# EAGLE design Amplifier_AB_V1 (EAGLE 7.7.0)
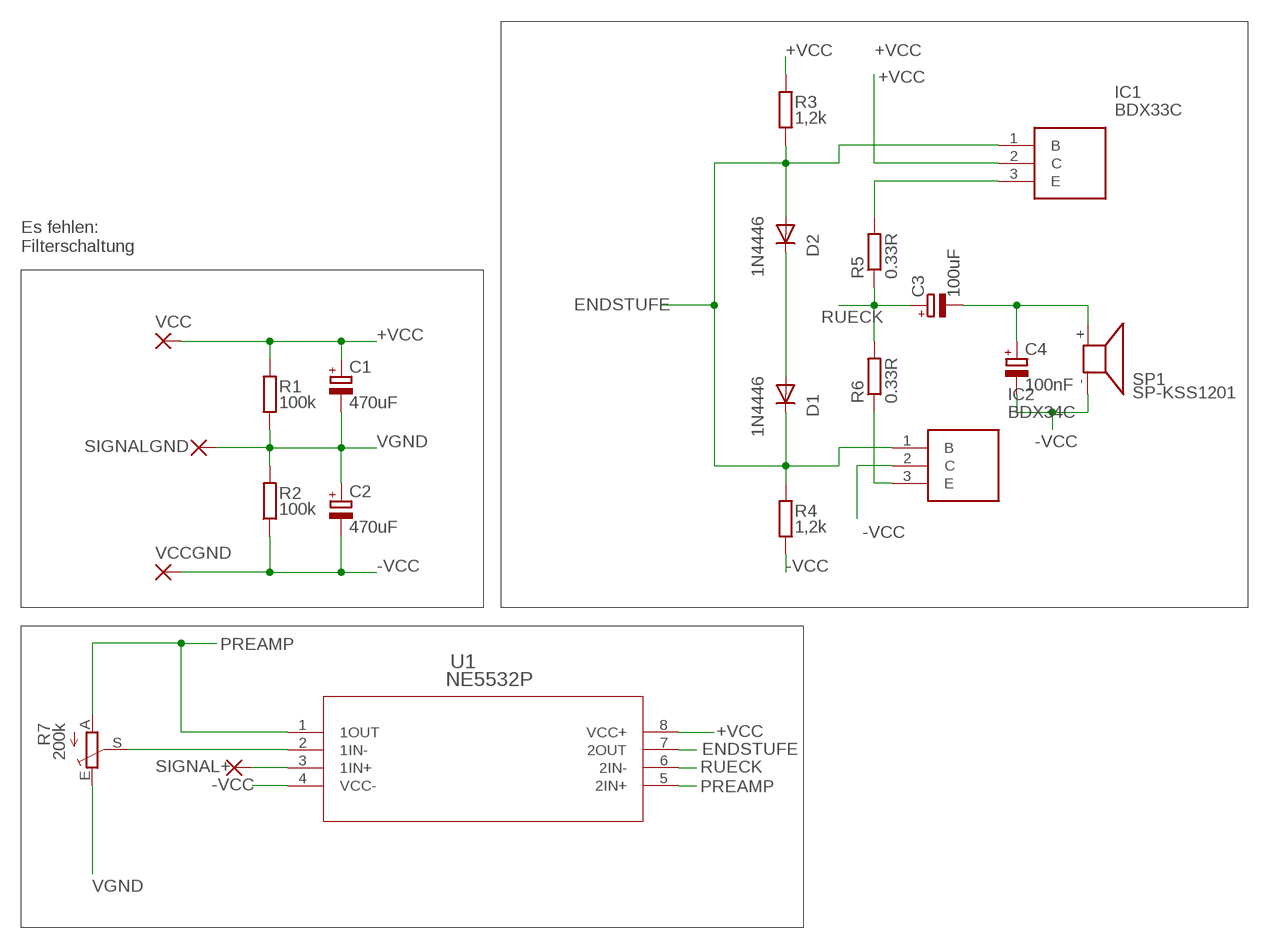
[diagram p0: schematic, sheet 1]

## Parts
C1  470uF  CE_2,5-5  [2,5-5]
C2  470uF  CE_2,5-5  [2,5-5]
C3  100uF  CE_5-10,5  [5-10,5]
C4  100nF  CE_5-10,5  [5-10,5]
D1  1N4446  [DO35-10]
D2  1N4446  [DO35-10]
IC1  BDX33C  [TO270P460X1020X2008-3P]
IC2  BDX34C  [TO270P460X1020X2008-3P]
R1  100k  R10  [0207/10]
R2  100k  R10  [0207/10]
R3  1,2k  R10  [0207/10]
R4  1,2k  R10  [0207/10]
R5  0.33R  R-EU_0309/12  [0309/12]
R6  0.33R  R-EU_0309/12  [0309/12]
R7  200k  TRIM_EU-CT6  [CT6]
SIGNAL+  2,15/1,0  [2,15/1,0]
SIGNALGND  2,15/1,0  [2,15/1,0]
SP1  SP-KSS1201  [SP-KSS1201]
U1  NE5532P  [P8]
VCC  2,15/1,0  [2,15/1,0]
VCCGND  2,15/1,0  [2,15/1,0]

## Nets
+VCC: C1.+ IC1.2(C) R1.2 R3.2 U1.8(VCC+) VCC.1(P)
-VCC: C2.- C4.- IC2.2(C) R2.1 R4.1 SP1.- U1.4(VCC-) VCCGND.1(P)
ENDSTUFE: D1.C D2.A IC1.1(B) IC2.1(B) R3.1 R4.2 U1.7(2OUT)
N$1: IC1.3(E) R5.2
N$2: R7.S U1.2(1IN-)
N$3: C3.- C4.+ SP1.+
N$4: D1.A D2.C
N$5: IC2.3(E) R6.1
N$6: SIGNAL+.1(P) U1.3(1IN+)
PREAMP: R7.A U1.1(1OUT) U1.5(2IN+)
RUECK: C3.+ R5.1 R6.2 U1.6(2IN-)
VGND: C1.- C2.+ R1.1 R2.2 R7.E SIGNALGND.1(P)

## Notes on the sheet
- Es fehlen:
  Filterschaltung

## Library data of the parts
C1-C4 = 0_HTL_analog:CE*: Elko
D1 D2 = diode:1N4446: DIODE high speed (Philips)
IC1 = BDX33C:BDX33C: BDX33C, Darlington Transistor, NPN 10 A 100 V HFE:750, 3-Pin, TO-220 Source: Datasheet <http://www.st.com/web/en/resource/technical/document/datasheet/CD00000901.pdf>; DESCRIPTION: BDX33C, Darlington Transistor, NPN 10 A 100 V HFE:750, 3-Pin, TO-220; HEIGHT: 4.6mm; MANUFACTURER_NAME: STMicroelectronics; MANUFACTURER_PART_NUMBER: BDX33C; MOUSER_PART_NUMBER: 511-BDX33C; MOUSER_PRICE-STOCK: https://www.mouser.co.uk/ProductDetail/STMicroelectronics/BDX33C?qs=W6IoFmhM3rXCvTnlzdpsKw%3D%3D
IC2 = BDX34C:BDX34C: BDX34C, Darlington Transistor, PNP 10 A 100 V HFE:750, 3-Pin, TO-220 Source: Datasheet <http://www.st.com/web/en/resource/technical/document/datasheet/CD00000901.pdf>; DESCRIPTION: BDX34C, Darlington Transistor, PNP 10 A 100 V HFE:750, 3-Pin, TO-220; HEIGHT: 4.6mm; MANUFACTURER_NAME: STMicroelectronics; MANUFACTURER_PART_NUMBER: BDX34C; MOUSER_PART_NUMBER: 511-BDX34C; MOUSER_PRICE-STOCK: https://www.mouser.co.uk/ProductDetail/STMicroelectronics/BDX34C?qs=vrHyyfhkd3JVtBIF%2FbOetQ%3D%3D
R1-R4 = 0_HTL_analog:R: Widerstand
R5 R6 = rcl:R-EU_: RESISTOR, European symbol
R7 = pot:TRIM_EU-: POTENTIOMETER
SIGNAL+ SIGNALGND VCC VCCGND = wirepad:2,15/1,0: THROUGH-HOLE PAD
SP1 = 0_HTL_MegaCard_V3:SP-KSS1201: SPEAKER Source: Schukat
U1 = NE332OP:NE5532P; COPYRIGHT: Copyright (C) 2023 Ultra Librarian. All rights reserved.; MANUFACTURER_PART_NUMBER: NE5532P; MFR_NAME: Texas Instruments

## Board
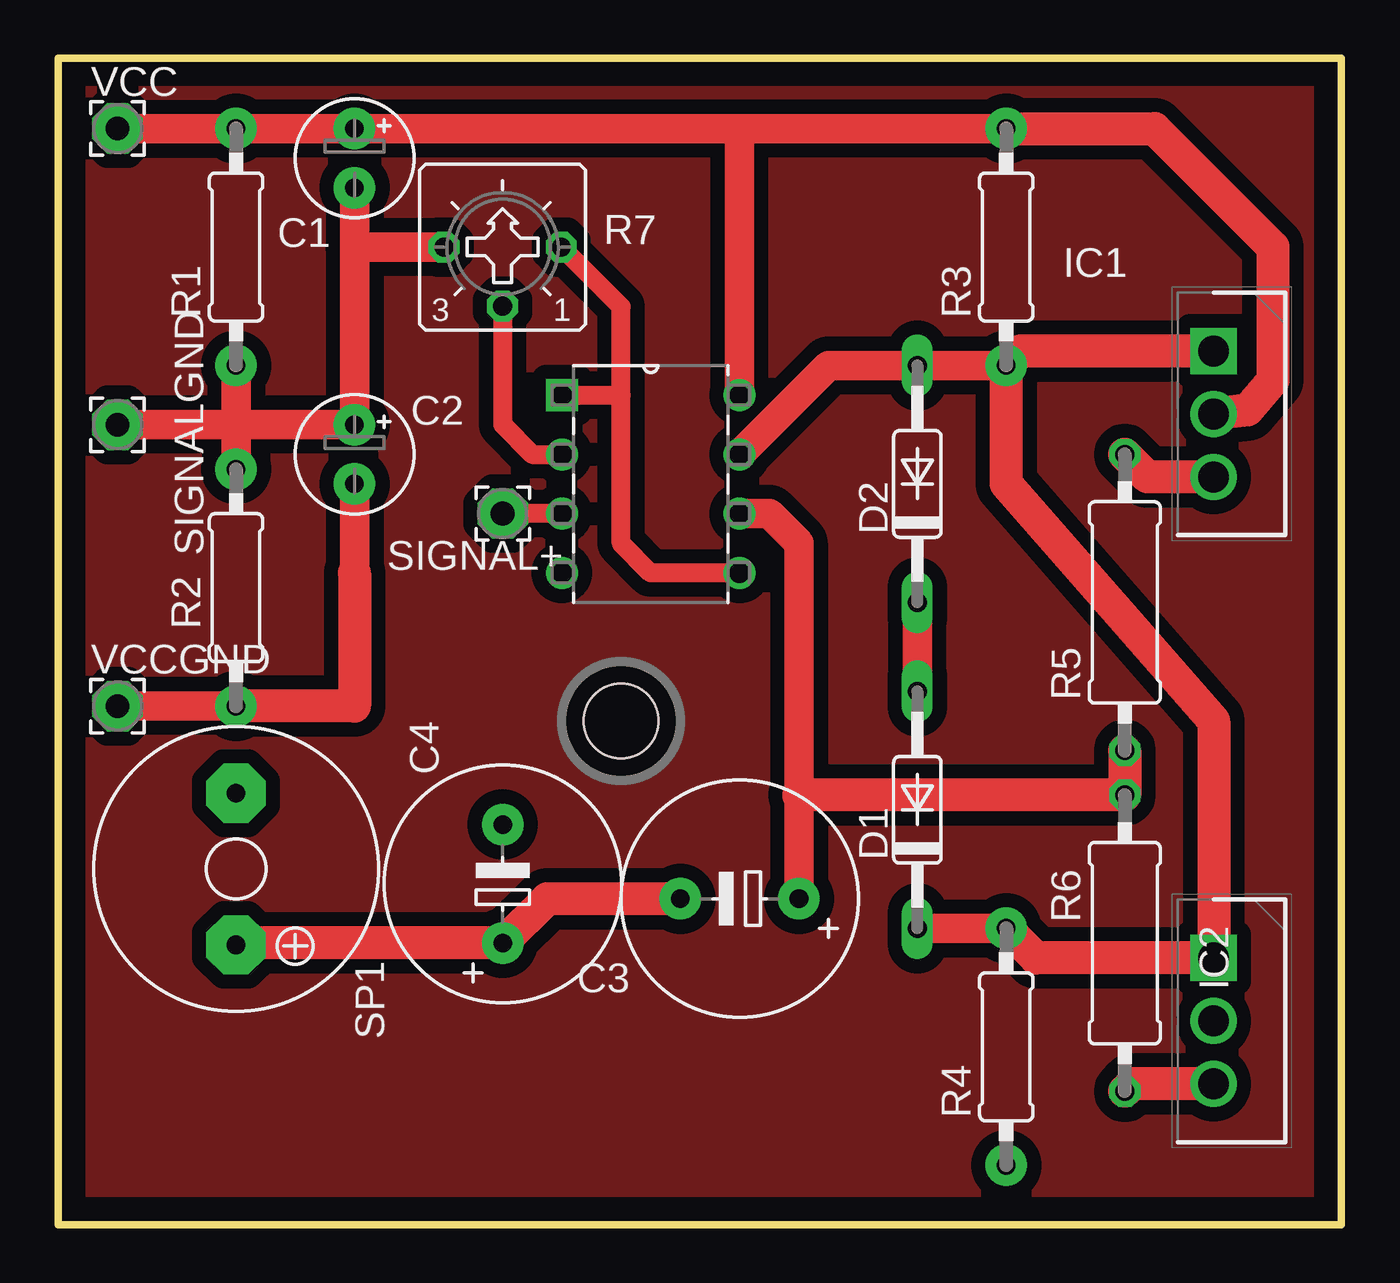
[diagram p1: board, top side]
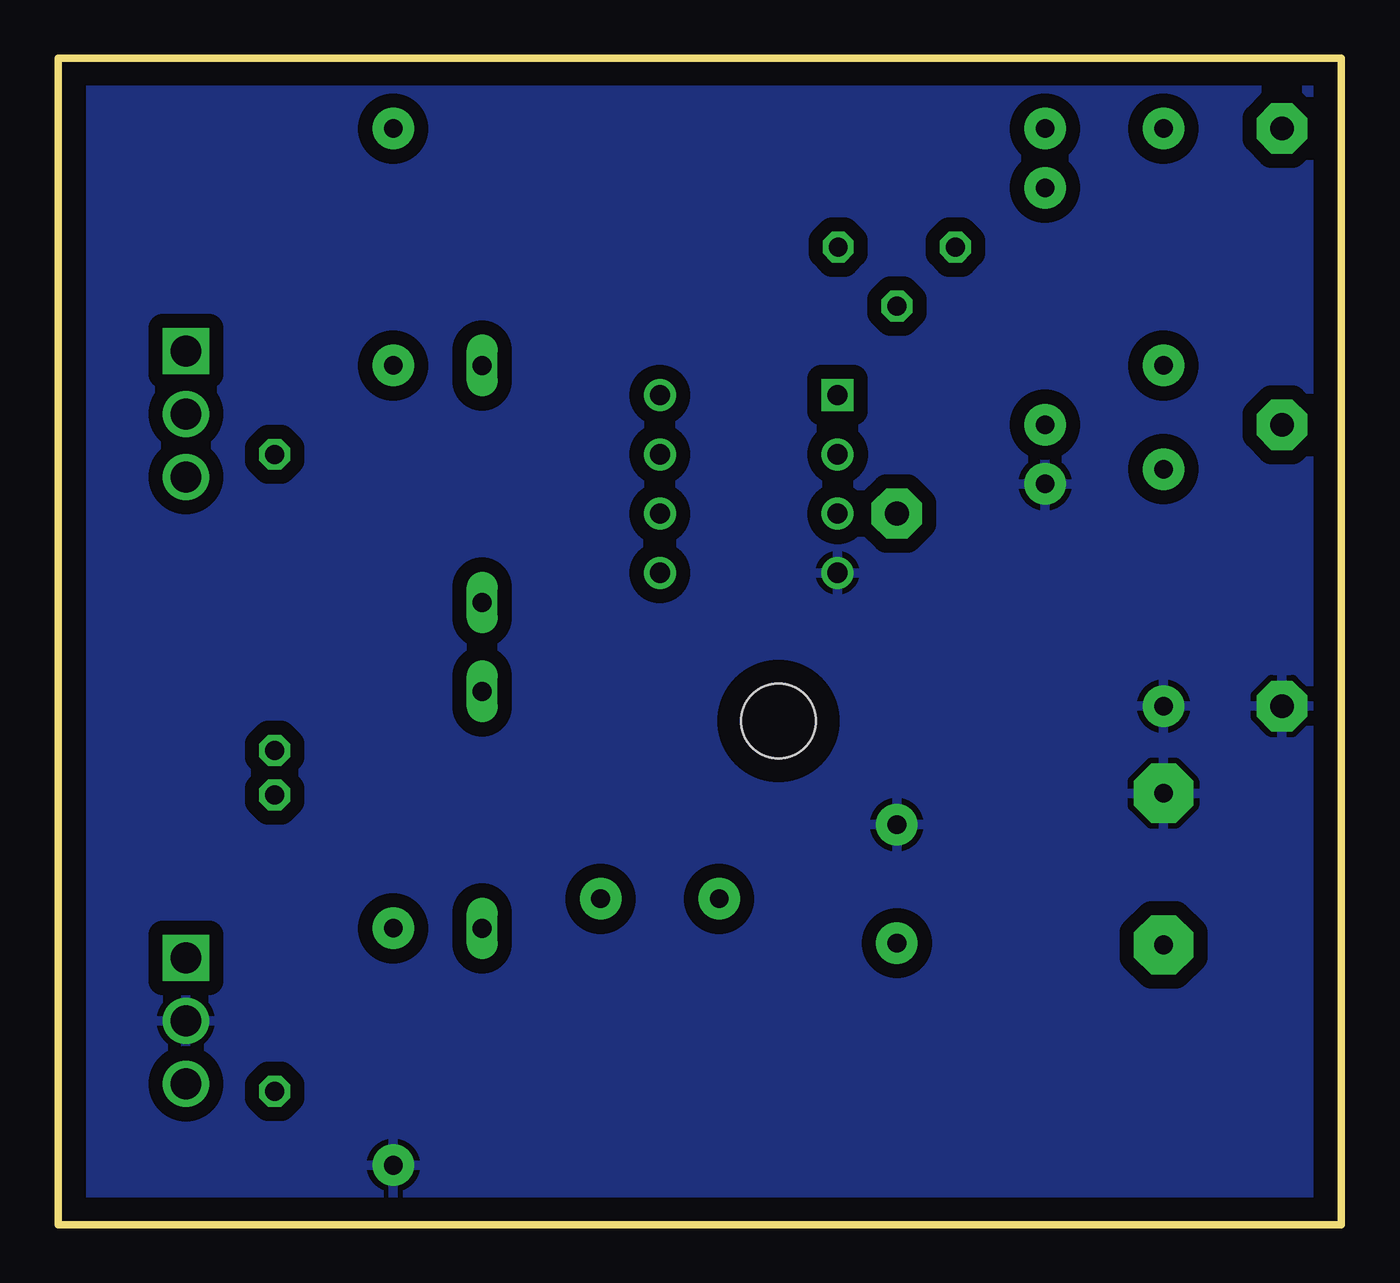
[diagram p2: board, bottom side, seen from below]

Size 55 x 50 mm. Coordinates in mm from the lower left corner, seen from the top.
Outline: 0,0 0,50 55,50 55,0 0,0
Copper layers (1*16): Top 0.035mm / dielectric 1.5mm / Bottom 0.035mm
Design rules "default": minimum track width 10mil, minimum drill 24mil, track to track 8mil, track to pad 8mil, pad to pad 8mil, via to via 8mil, smd to smd 8mil, copper to edge 40mil, drill to drill 8mil, minimum pad ring 10mil, minimum via ring 8mil, stop-mask expansion 4mil, vias tented up to drill 0mil, thermal gap 10mil
Holes 3.2 mm at 24.13,21.59

### Footprints (pad centres in the part's own frame; a part is rotated, then mirrored left to right if it is on the bottom)
2,5-5 = drill 0.8 pad 1.778: + -1.27,0; - 1.27,0
5-10,5 = drill 0.8 pad 1.778: + -2.54,0; - 2.54,0
DO35-10 = drill 0.813 long: A 5.08,0; C -5.08,0
TO270P460X1020X2008-3P = drill 1.32 pad 1.98 square: 1 0,0 | drill 1.32 pad 1.98: 2 2.7,0; 3 5.4,0
0207/10 = drill 0.8 pad 1.778: 1 -5.08,0; 2 5.08,0
0309/12 = drill 0.813 octagon: 1 -6.35,0; 2 6.35,0
CT6 = drill 0.813 octagon: A 2.515,0; E -2.515,0; S 0,-2.54
2,15/1,0 = drill 1.016 pad 2.159 octagon: 1 0,0
SP-KSS1201 = drill 0.8 pad 2.54 octagon: + 3.251,0; - -3.251,0
P8 = drill 0.864 pad 1.372 square: 1 -7.62,7.62 | drill 0.864 pad 1.372: 2 -7.62,5.08; 3 -7.62,2.54; 4 -7.62,0; 5 0,0; 6 0,2.54; 7 0,5.08; 8 0,7.62

### Placement (x,y rotation side)
C1  12.7,45.72 270 top
C2  12.7,33.02 270 top
C3  29.21,13.97 180 top
C4  19.05,14.61 90 top
D1  36.83,17.78 90 top
D2  36.83,31.75 90 top
IC1  49.53,37.45 270 top
IC2  49.53,11.43 270 top
R1  7.62,41.91 90 top
R2  7.62,27.3 90 top
R3  40.64,41.91 90 top
R4  40.64,7.62 90 top
R5  45.72,26.67 90 top
R6  45.72,12.06 90 top
R7  19.05,41.91 0 top
SIGNAL+  19.05,30.48 0 top
SIGNALGND  2.54,34.29 0 top
SP1  7.62,15.24 270 top
U1  29.21,27.94 0 top
VCC  2.54,46.99 0 top
VCCGND  2.54,22.23 0 top

### Tracks (layer width: path | path; a pad name or v marks a point on that pad's centre or on a via)
+VCC
  Top 1.27: VCC.1 R1.2 C1.+ 29.21,46.99 | R3.2 29.21,46.99 | U1.8 29.21,46.99
  Top 1.422: R3.2 46.99,46.99 52.07,41.91 52.07,36.2 50.98,34.92 IC1.2
-VCC
  Top 1.27: R2.1 VCCGND.1 | C2.- 12.7,27.94
  Top 1.422: 12.7,27.94 12.7,22.23 R2.1
  pour Bottom (isolate 0.61): 0,0 0,50 55,50 55,0
ENDSTUFE
  Top 1.27: R3.1 D2.A 33.02,36.83 U1.7 | D1.C R4.2
  Top 1.422: IC1.1 41.26,37.45 R3.1 40.64,31.75 49.53,21.59 IC2.1 41.91,11.43 R4.2
GND
  pour Top (isolate 0.61): 0,0 0,50 55,50 55,0
N$1
  Top 1.422: IC1.3 46.69,32.05 R5.2
N$2
  Top 0.813: R7.S 19.05,34.29 20.32,33.02 U1.2
N$3
  Top 1.422: C3.- 20.95,13.97 C4.+ 7.7,12.06 SP1.+
N$4
  Top 1.27: D1.A D2.C
N$5
  Top 1.422: IC2.3 46.03,6.03 R6.1
N$6
  Top 0.813: U1.3 SIGNAL+.1
PREAMP
  Top 0.813: U1.5 25.4,27.94 24.13,29.21 24.13,35.56 | 24.13,35.56 24.13,39.34 R7.A | U1.1 24.13,35.56
RUECK
  Top 1.27: U1.6 30.48,30.48 31.75,29.21 31.75,18.41 C3.+
  Top 1.422: R5.1 R6.2 31.75,18.41
VGND
  Top 1.27: C1.- 12.7,41.91 | 12.7,41.91 C2.+ 7.62,34.29 | R7.E 12.7,41.91 | R2.2 7.62,34.29 | 7.62,34.29 SIGNALGND.1 | R1.1 7.62,34.29

### Text on the board
tDocu: Pius Bickel, Niko Leimegger / 4CHEL, 2022/23 / Leslie Speaker Amp / Class AB Amplifier